# EAGLE design controller (EAGLE 7.1.0)
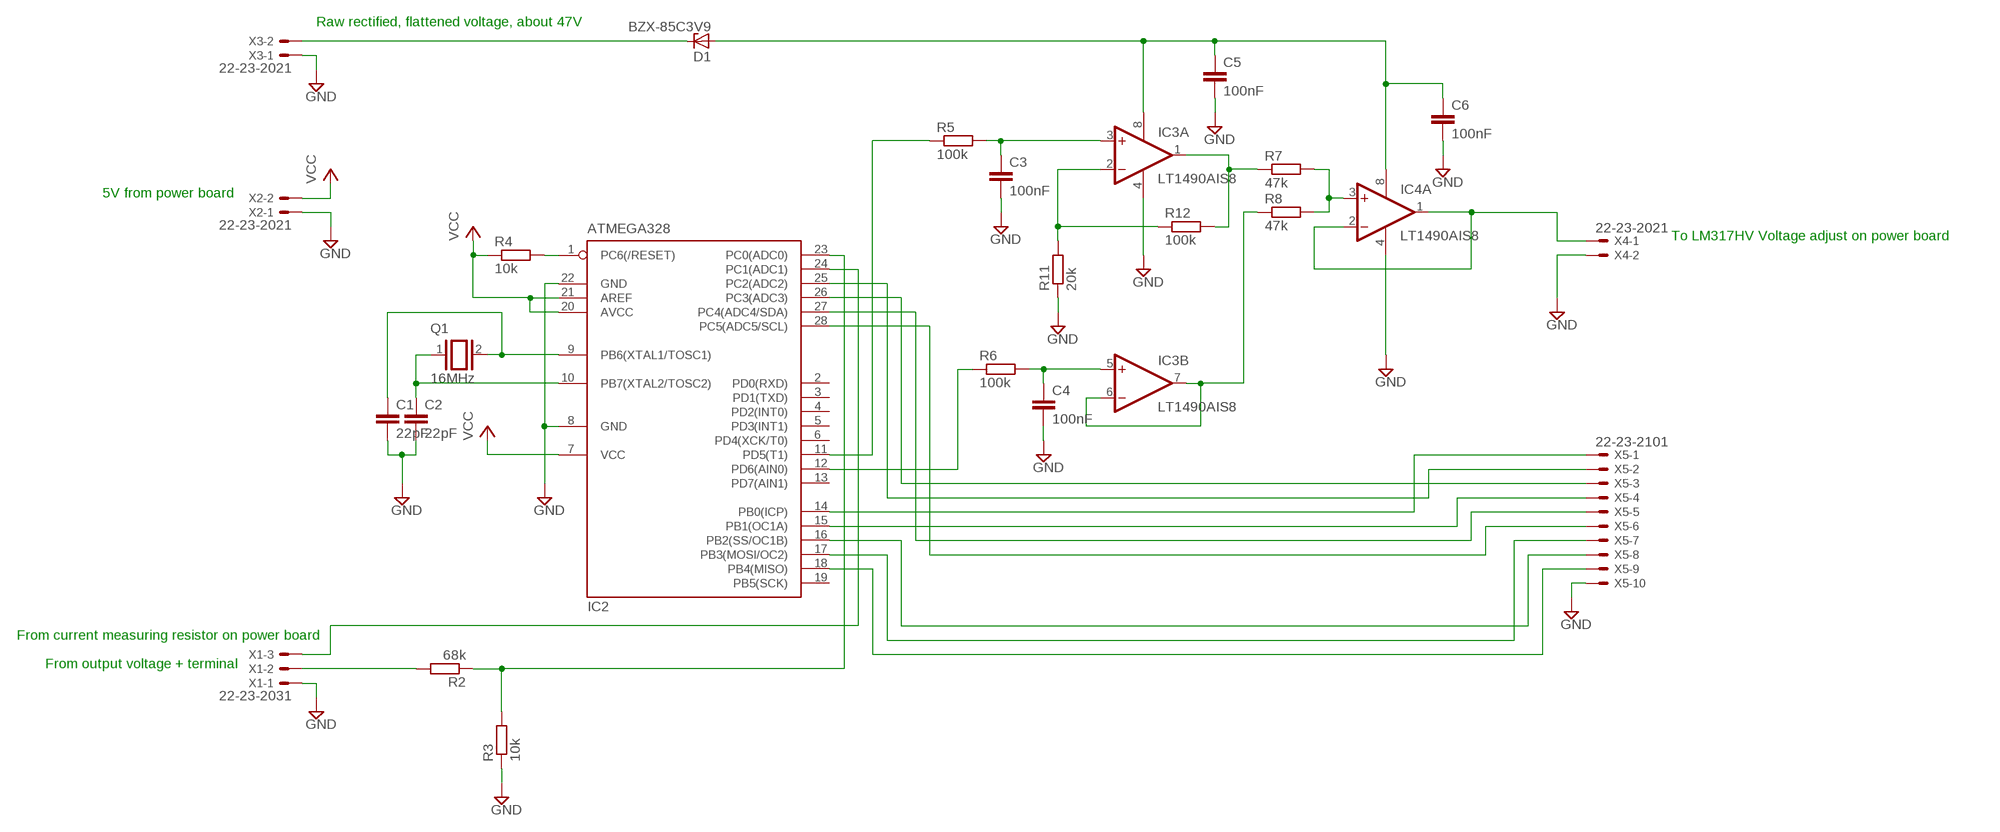
[diagram p0: schematic, sheet 1]

## Parts
C1  22pF  C2.5/2  [C2.5-2]
C2  22pF  C2.5/2  [C2.5-2]
C3  100nF  C7.5/3  [C7.5B3]
C4  100nF  C7.5/3  [C7.5B3]
C5  100nF  C7.5/3  [C7.5B3]
C6  100nF  C7.5/3  [C7.5B3]
D1  BZX-85C3V9  BZX90  [DO34Z7]
IC2  ATMEGA328  MEGA8-P  [DIL28-3]
IC3  LT1490AIS8  OPA2134UA  [SO08]
IC4  LT1490AIS8  OPA2134UA  [SO08]
Q1  16MHz  XTAL/S  [QS]
R2  68k  R-EU_0207/10  [0207/10]
R3  10k  R-EU_0207/10  [0207/10]
R4  10k  R-EU_0207/10  [0207/10]
R5  100k  R-EU_0207/10  [0207/10]
R6  100k  R-EU_0207/10  [0207/10]
R7  47k  R-EU_0207/10  [0207/10]
R8  47k  R-EU_0207/10  [0207/10]
R11  20k  R-EU_0207/10  [0207/10]
R12  100k  R-EU_0207/10  [0207/10]
X1  22-23-2031  [22-23-2031]
X2  22-23-2021  [22-23-2021]
X3  22-23-2021  [22-23-2021]
X4  22-23-2021  [22-23-2021]
X5  22-23-2101  [22-23-2101]

## Nets
GND: C1.2 C2.2 C3.2 C4.2 C5.2 C6.2 IC2.8(GND) IC2.22(GND) IC3.4(A:V-) IC4.4(A:V-) R3.1 R11.1 X1.1 X2.1 X3.1 X4.2 X5.10
N$1: IC2.18(PB4(MISO)) X5.9
N$2: IC2.16(PB2(SS/OC1B)) X5.8
N$3: IC2.17(PB3(MOSI/OC2)) X5.7
N$4: IC2.7(VCC) IC2.20(AVCC) IC2.21(AREF) R4.1 X2.2 ; supply symbol labelled VCC
N$5: IC3.1(A:OUT) R7.1 R12.2
N$7: IC2.14(PB0(ICP)) X5.1
N$21: IC2.24(PC1(ADC1)) X1.3
N$22: IC2.23(PC0(ADC0)) R2.1 R3.2
N$23: R2.2 X1.2
N$24: C1.1 IC2.9(PB6(XTAL1/TOSC1)) Q1.2
N$25: C2.1 IC2.10(PB7(XTAL2/TOSC2)) Q1.1
N$26: IC3.6(B:-IN) IC3.7(B:OUT) R8.1
N$27: IC2.11(PD5(T1)) R5.1
N$28: IC2.1(PC6(/RESET)) R4.2
N$29: C3.1 IC3.3(A:+IN) R5.2
N$30: C4.1 IC3.5(B:+IN) R6.2
N$31: C5.1 C6.1 D1.A IC3.8(A:V+) IC4.8(A:V+)
N$32: IC2.12(PD6(AIN0)) R6.1
N$33: IC4.3(A:+IN) R7.2 R8.2
N$35: IC3.2(A:-IN) R11.2 R12.1
N$36: IC4.1(A:OUT) IC4.2(A:-IN) X4.1
N$38: IC2.15(PB1(OC1A)) X5.4
N$40: IC2.25(PC2(ADC2)) X5.2
N$41: IC2.28(PC5(ADC5/SCL)) X5.6
N$42: IC2.27(PC4(ADC4/SDA)) X5.5
N$43: D1.C X3.2
N$45: IC2.26(PC3(ADC3)) X5.3
Unconnected: IC2.2(PD0(RXD)) IC2.3(PD1(TXD)) IC2.4(PD2(INT0)) IC2.5(PD3(INT1)) IC2.6(PD4(XCK/T0)) IC2.13(PD7(AIN1)) IC2.19(PB5(SCK)) IC4.5(B:+IN) IC4.6(B:-IN) IC4.7(B:OUT)

## Notes on the sheet
- Raw rectified, flattened voltage, about 47V
- 5V from power board
- To LM317HV Voltage adjust on power board
- From current measuring resistor on power board
- From output voltage + terminal

## Library data of the parts
C1-C6 = capacitor-wima:C: CAPACITOR naming: grid - package width
D1 = diode:BZX90: Z DIODE
IC2 = atmel:MEGA8-P: MICROCONTROLLER 8 Kbytes FLASH, 1 kbytes SRAM, 512 bytes EEPROM, USART, 4-channel 10 bit ADC, 2-channel 8 bit ADC Pin compatible with Atmega48, ATMega88, ATMega168 Source: avr.lbr; OC_FARNELL: unknown; OC_NEWARK: unknown
IC3 IC4 = linear:OPA2*: Dual Operational Amplifier Low Power, Single-Supply, Rail-To-Rail Operational Amplifier Source: http://focus.ti.com/lit/ds/symlink/opa2345.pdf http://focus.ti.com .. opa241.pdf http://focus.ti.com/lit/ds/symlink/opa2134.pdf
Q1 = special:XTAL/S: CRYSTAL
R2-R8 R11 R12 = rcl:R-EU_: RESISTOR, European symbol
X1 = con-molex:22-23-2031: .100" (2.54mm) Center Header - 3 Pin; MF: MOLEX; MPN: 22-23-2031; OC_FARNELL: 1462950; OC_NEWARK: 30C0862
X2-X4 = con-molex:22-23-2021: .100" (2.54mm) Center Header - 2 Pin; MF: MOLEX; MPN: 22-23-2021; OC_FARNELL: 1462926; OC_NEWARK: 25C3832
X5 = con-molex:22-23-2101: .100" (2.54mm) Center Header - 10 Pin; MF: MOLEX; MPN: 22-23-2101; OC_FARNELL: 1756828; OC_NEWARK: 94C0765

## Board
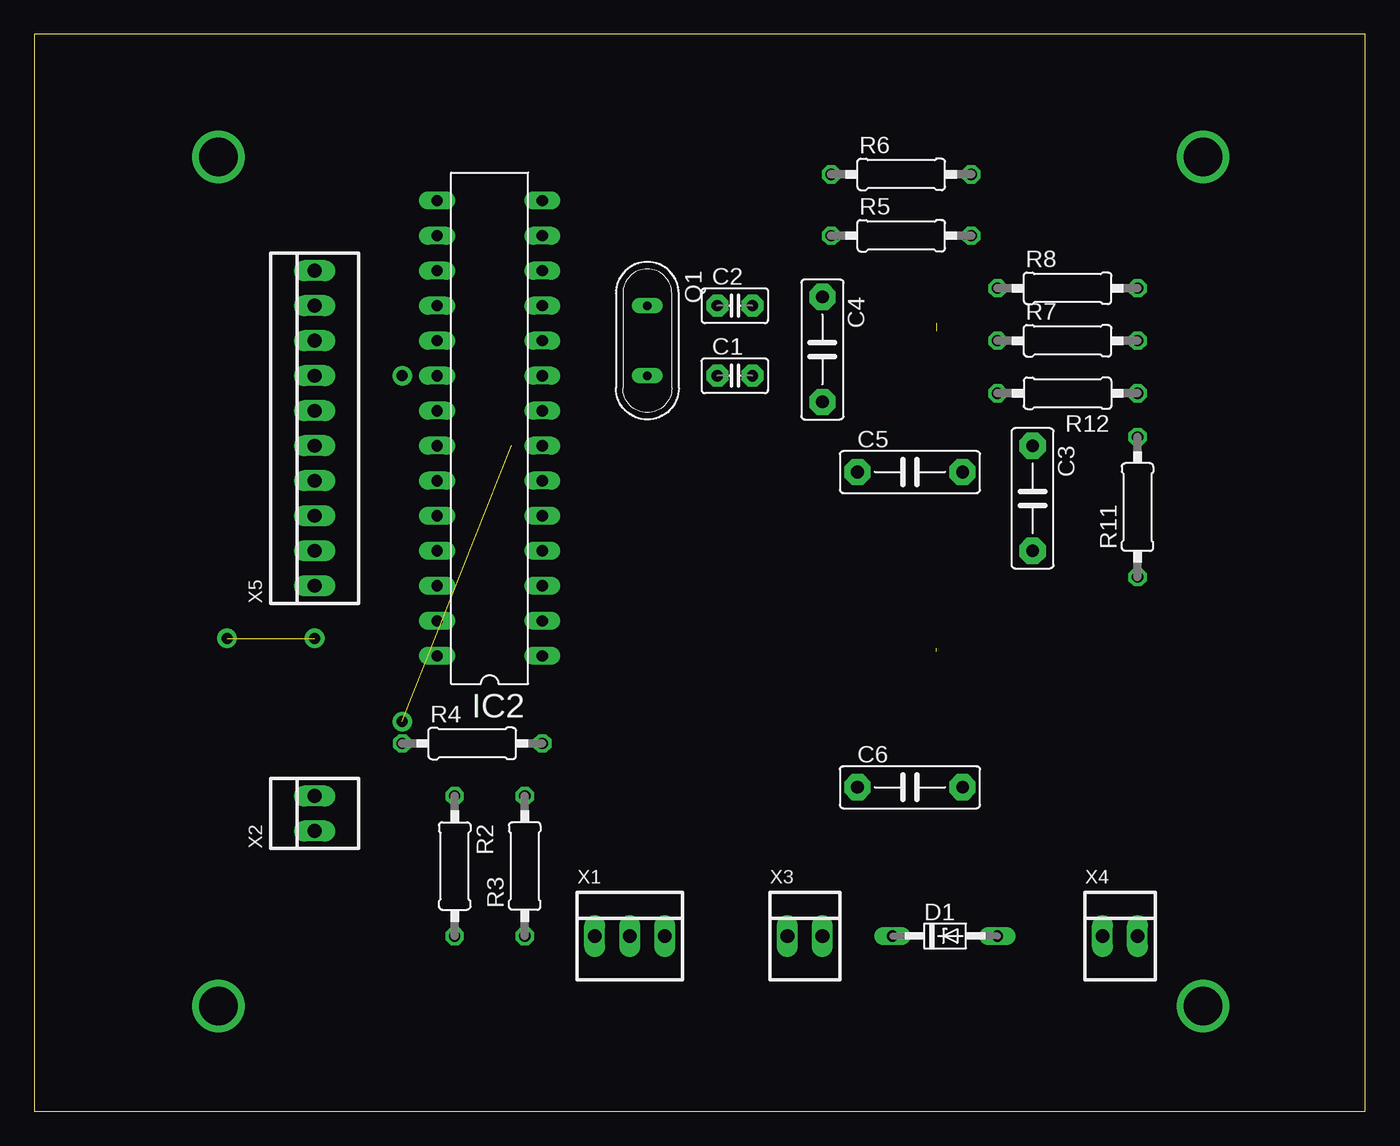
[diagram p1: board, top side]
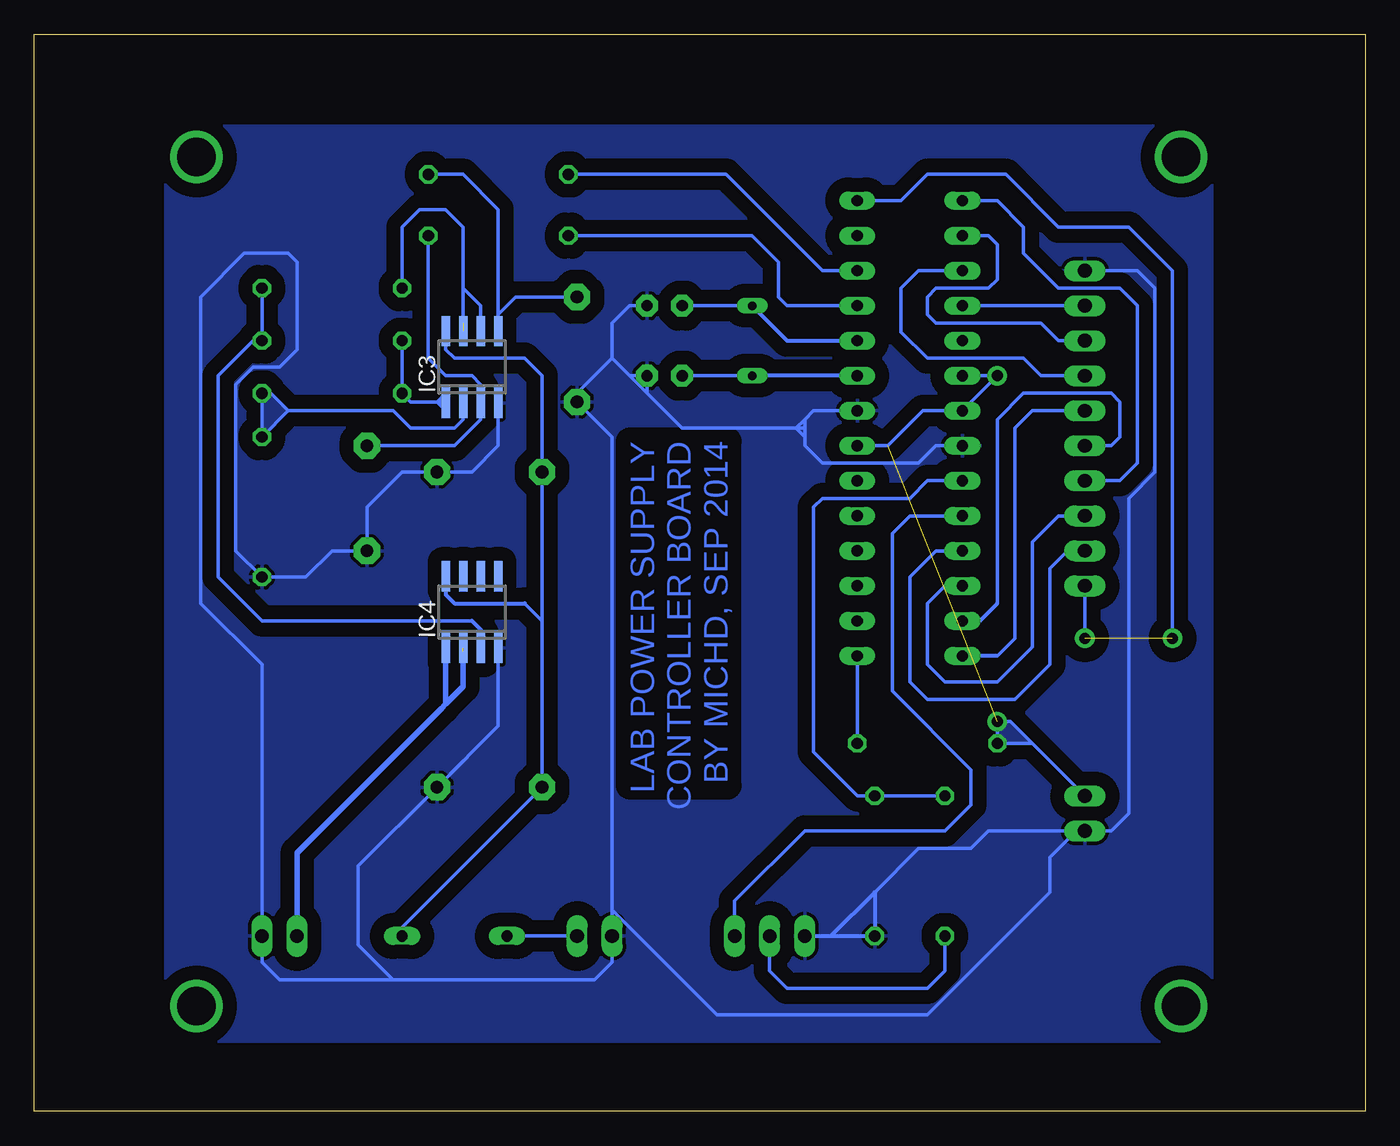
[diagram p2: board, bottom side, seen from below]

Size 96.51 x 78.09 mm. Coordinates in mm from the lower left corner, seen from the top.
Outline: 0,0 96.51,0 96.51,78.09 0,78.09 0,0
Copper layers (1*16): Top 0.035mm / dielectric 1.5mm / Bottom 0.035mm
Design rules "default": minimum track width 10mil, minimum drill 24mil, track to track 8mil, track to pad 8mil, pad to pad 8mil, via to via 8mil, smd to smd 8mil, copper to edge 40mil, drill to drill 8mil, minimum pad ring 10mil, minimum via ring 8mil, stop-mask expansion 4mil, vias tented up to drill 0mil, thermal gap 10mil

### Footprints (pad centres in the part's own frame; a part is rotated, then mirrored left to right if it is on the bottom)
C2.5-2 = drill 0.813 pad 1.6 octagon: 1 -1.27,0; 2 1.27,0
C7.5B3 = drill 0.914 pad 1.905 octagon: 1 -3.81,0; 2 3.81,0
DO34Z7 = drill 0.813 long: A 3.81,0; C -3.81,0
DIL28-3 = drill 0.813 long: 1 -16.51,-3.81; 2 -13.97,-3.81; 3 -11.43,-3.81; 4 -8.89,-3.81; 5 -6.35,-3.81; 6 -3.81,-3.81; 7 -1.27,-3.81; 8 1.27,-3.81; 9 3.81,-3.81; 10 6.35,-3.81; 11 8.89,-3.81; 12 11.43,-3.81; 13 13.97,-3.81; 14 16.51,-3.81; 15 16.51,3.81; 16 13.97,3.81; 17 11.43,3.81; 18 8.89,3.81; 19 6.35,3.81; 20 3.81,3.81; 21 1.27,3.81; 22 -1.27,3.81; 23 -3.81,3.81; 24 -6.35,3.81; 25 -8.89,3.81; 26 -11.43,3.81; 27 -13.97,3.81; 28 -16.51,3.81
SO08 = smd 0.6 x 2.2: 1 -1.905,-2.6; 2 -0.635,-2.6; 3 0.635,-2.6; 4 1.905,-2.6; 5 1.905,2.6; 6 0.635,2.6; 7 -0.635,2.6; 8 -1.905,2.6
QS = drill 0.61 long: 1 -2.54,0; 2 2.54,0
0207/10 = drill 0.813 octagon: 1 -5.08,0; 2 5.08,0
22-23-2031 = drill 1 long: 1 -2.54,0; 2 0,0; 3 2.54,0
22-23-2021 = drill 1 long: 1 -1.27,0; 2 1.27,0
22-23-2101 = drill 1 long: 1 -11.43,0; 2 -8.89,0; 3 -6.35,0; 4 -3.81,0; 5 -1.27,0; 6 1.27,0; 7 3.81,0; 8 6.35,0; 9 8.89,0; 10 11.43,0

### Placement (x,y rotation side)
C1  50.8,53.34 0 top
C2  50.8,58.42 0 top
C3  72.39,44.45 270 top
C4  57.15,55.24 270 top
C5  63.5,46.35 0 top
C6  63.5,23.5 0 top
D1  66.04,12.7 0 top
IC2  33.02,49.53 90 top
IC3  64.77,53.98 0 bottom
IC4  64.77,36.2 0 bottom
Q1  44.45,55.88 270 top
R2  30.48,17.78 270 top
R3  35.56,17.78 90 top
R4  31.75,26.67 0 top
R5  62.87,63.5 0 top
R6  62.87,67.94 0 top
R7  74.93,55.88 0 top
R8  74.93,59.69 0 top
R11  80.01,43.81 90 top
R12  74.93,52.07 180 top
X1  43.18,12.7 0 top
X2  20.32,21.59 90 top
X3  55.88,12.7 0 top
X4  78.74,12.7 0 top
X5  20.32,49.53 90 top

### Tracks (layer width: path | path; a pad name or v marks a point on that pad's centre or on a via)
GND
  Bottom 0.254: IC4.4 62.87,27.94 C6.2 | IC3.4 62.87,48.26 64.77,46.35 C5.2 69.85,46.35 72.39,43.81 C3.2 74.93,40.64 76.83,38.73 R11.1 81.92,40.64 81.92,52.7 80.64,53.98 78.74,53.98 77.47,55.24 77.47,61.59 78.11,62.23 81.28,62.23 84.45,59.05 84.45,36.83 80.01,32.38 X4.2 80.01,10.79 78.74,9.53 70.48,9.53 | C2.2 53.34,58.42 54.61,57.15 54.61,54.61 | 54.61,54.61 53.34,53.34 | 53.34,53.34 C1.2 52.07,52.07 | 65.41,25.4 C6.2 | 54.61,54.61 57.15,52.07 C4.2 54.61,48.9 54.61,14.61 | 54.61,14.61 X3.1 54.61,10.79 55.88,9.53 70.48,9.53 | 70.48,9.53 73.03,12.06 73.03,17.78 C6.2 | 20.95,20.32 X2.1 18.41,20.32 17.14,21.59 17.14,44.45 15.24,46.35 15.24,59.69 16.51,60.96 X5.10 | 20.95,20.32 27.3,20.32 28.57,19.05 32.38,19.05 35.56,15.88 | X1.1 38.73,12.7 | 54.61,14.61 46.99,6.99 31.75,6.99 22.86,15.88 22.86,18.41 20.95,20.32 | IC2.8 40.01,50.8 40.64,50.16 | 40.64,50.16 40.64,49.53 | 40.64,49.53 40.64,48.9 | 40.64,48.9 40.64,48.26 39.37,46.99 32.38,46.99 31.11,48.26 IC2.22 | 41.27,49.53 49.53,49.53 52.07,52.07 | 41.27,49.53 40.64,49.53 | 40.64,50.16 41.27,49.53 | 41.27,49.53 40.64,48.9 | 53.34,53.34 52.07,52.07
  Bottom 0.305: X1.1 R3.1 35.56,15.88 38.73,12.7
  pour Bottom: 40.64,50.16 40.64,48.9 41.27,49.53
  pour Bottom: 52.07,53.34 53.34,53.34 52.07,52.07
  pour Bottom (isolate 1.016): 11.11,71.44 87,71.44 87,5.08 11.11,5.08
N$1
  Bottom 0.254: X5.9 IC2.18
N$2
  Bottom 0.254: X5.8 22.23,55.88 23.5,57.15 31.11,57.15 31.75,57.78 31.75,59.05 31.11,59.69 27.3,59.69 26.67,60.33 26.67,62.87 27.3,63.5 IC2.16
N$3
  Bottom 0.254: X5.7 23.5,53.34 24.77,54.61 31.75,54.61 33.66,56.52 33.66,59.69 32.38,60.96 IC2.17
N$4  (via drill 0.8 pad 1.42)  (1 unrouted)
  Bottom 0.254: 24.13,26.67 X2.2 | 24.13,26.67 25.72,28.26 v26.67,28.26 R4.1 24.13,26.67 | IC2.7 34.61,48.26 32.07,50.8 IC2.21 v26.67,53.34 IC2.20 28.57,53.34
  pour Bottom (no thermals): 26.67,28.26 25.72,28.26 24.13,26.67 26.67,26.67
N$5
  Bottom 0.254: R7.1 R12.2 69.22,51.44 67.31,51.44 | 66.73,51.44 IC3.1 | 67.31,51.44 66.67,52.07 66.67,51.44 | 67.31,51.44 66.67,50.8 66.67,51.44 | 66.67,51.44 66.73,51.44 | 67.31,51.44 66.73,51.44
  pour Bottom (no thermals): 66.67,52.07 66.67,50.8 67.31,51.44
N$6  (via drill 2.8 pad 3.81)
  other vias: 13.34,69.22
N$7  (via drill 0.8 pad 1.42)  (1 unrouted)
  Bottom 0.254: IC2.14 33.66,66.04 31.75,67.94 26.04,67.94 22.23,64.14 17.14,64.14 13.97,60.96 v13.97,34.29 | v20.32,34.29 X5.1
N$8
  pour Bottom: 35.56,15.88 35.56,12.7 38.73,12.7
N$9  (via drill 2.8 pad 3.81)
  other vias: 13.34,7.62
N$11  (via drill 2.8 pad 3.81)
  other vias: 84.77,69.22
N$12  (via drill 2.8 pad 3.81)
  other vias: 84.77,7.62
N$21
  Bottom 0.254: X1.3 45.72,15.24 40.64,20.32 30.48,20.32 28.57,22.23 28.57,24.77 34.29,30.48 34.29,41.91 33.02,43.18 IC2.24
N$22
  Bottom 0.254: R2.1 R3.2 36.83,22.86 40.01,26.04 40.01,43.81 39.37,44.45 33.02,44.45 31.75,45.72 IC2.23
N$23
  Bottom 0.254: R2.2 30.48,10.16 31.75,8.89 41.91,8.89 43.18,10.16 X1.2
N$24
  Bottom 0.254: C1.1 Q1.2
  Bottom 0.305: IC2.9 Q1.2
N$25
  Bottom 0.254: Q1.1 C2.1
  Bottom 0.305: Q1.1 41.91,55.88 IC2.10
N$26  (1 unrouted)
  Bottom 0.254: R8.1 69.85,64.14 68.58,65.41 66.67,65.41 65.41,64.14 65.41,59.69 | 65.41,59.69 65.41,57.15 | IC3.6 64.14,58.42 65.41,59.69
N$27
  Bottom 0.254: IC2.11 41.91,58.42 42.55,59.05 42.55,61.59 44.45,63.5 R5.1
N$28
  Bottom 0.254: R4.2 IC2.1
N$29
  Bottom 0.254: C3.1 66.04,48.26 64.14,50.16 IC3.3 64.14,52.7 64.77,53.34 66.67,53.34 67.94,54.61 R5.2
N$30
  Bottom 0.254: C4.1 61.59,59.05 62.87,57.78 | 62.87,57.78 IC3.5 | R6.2 65.41,67.94 62.87,65.41 62.87,57.78
N$31
  Bottom 0.254: D1.A 69.85,13.34 C6.1 59.69,35.56 | IC3.8 66.67,55.24 66.04,54.61 60.96,54.61 59.69,53.34 C5.1 59.69,35.56 | 60.96,36.83 59.69,35.56
  Bottom 0.305: IC4.8 66.67,37.47 66.04,36.83 60.96,36.83
N$32
  Bottom 0.254: R6.1 46.35,67.94 39.37,60.96 IC2.12
N$33
  Bottom 0.254: 64.77,35.56 80.01,35.56 83.19,38.73 83.19,53.34 80.64,55.88 R7.2 R8.2
  Bottom 0.305: 64.77,35.56 64.14,34.92 IC4.3
N$35
  Bottom 0.254: 78.11,50.8 R11.2 R12.1 79.38,52.07 78.11,50.8 | 78.11,50.8 70.48,50.8 69.22,49.53 66.04,49.53 65.41,50.16 IC3.2
  pour Bottom (no thermals): 78.11,50.8 80.01,48.9 80.01,52.07 79.38,52.07
N$36  (1 unrouted)
  Bottom 0.406: IC4.1 66.67,29.53 | 66.67,29.53 66.99,29.21 77.47,18.73 X4.1 | 65.41,33.34 65.41,30.8 66.67,29.53
N$38
  Bottom 0.254: IC2.15 26.67,66.04 24.77,64.14 24.77,62.23 22.23,59.69 17.78,59.69 16.51,58.42 16.51,46.99 17.78,45.72 X5.4
N$40
  Bottom 0.254: X5.2 21.59,40.64 22.86,39.37 22.86,32.38 25.4,29.84 31.75,29.84 33.02,31.11 33.02,38.73 31.11,40.64 IC2.25
N$41
  Bottom 0.254: X5.6 24.13,50.8 25.4,49.53 25.4,34.29 26.67,33.02
  Bottom 0.305: 26.67,33.02 IC2.28
N$42
  Bottom 0.254: 26.67,36.83 26.67,50.16 24.77,52.07 18.41,52.07 17.78,51.44 17.78,48.9 18.41,48.26 X5.5
  Bottom 0.305: IC2.27 27.94,35.56 26.67,36.83
N$43
  Bottom 0.254: X3.2 D1.C
N$45
  Bottom 0.254: IC2.26 30.48,38.1 31.75,36.83 31.75,32.38 30.48,31.11 26.67,31.11 24.13,33.66 24.13,41.27 22.23,43.18 X5.3

### Text on the board
Bottom: LAB POWER SUPPLY / CONTROLLER BOARD / BY MICHD, SEP 2014